# Altium schematic sheet Sensors.SchDoc
size 209 x 297 mm; Author: ALTIUM GOSTBOM2.0 KEV; SheetNumber: 3; SheetTotal: 3
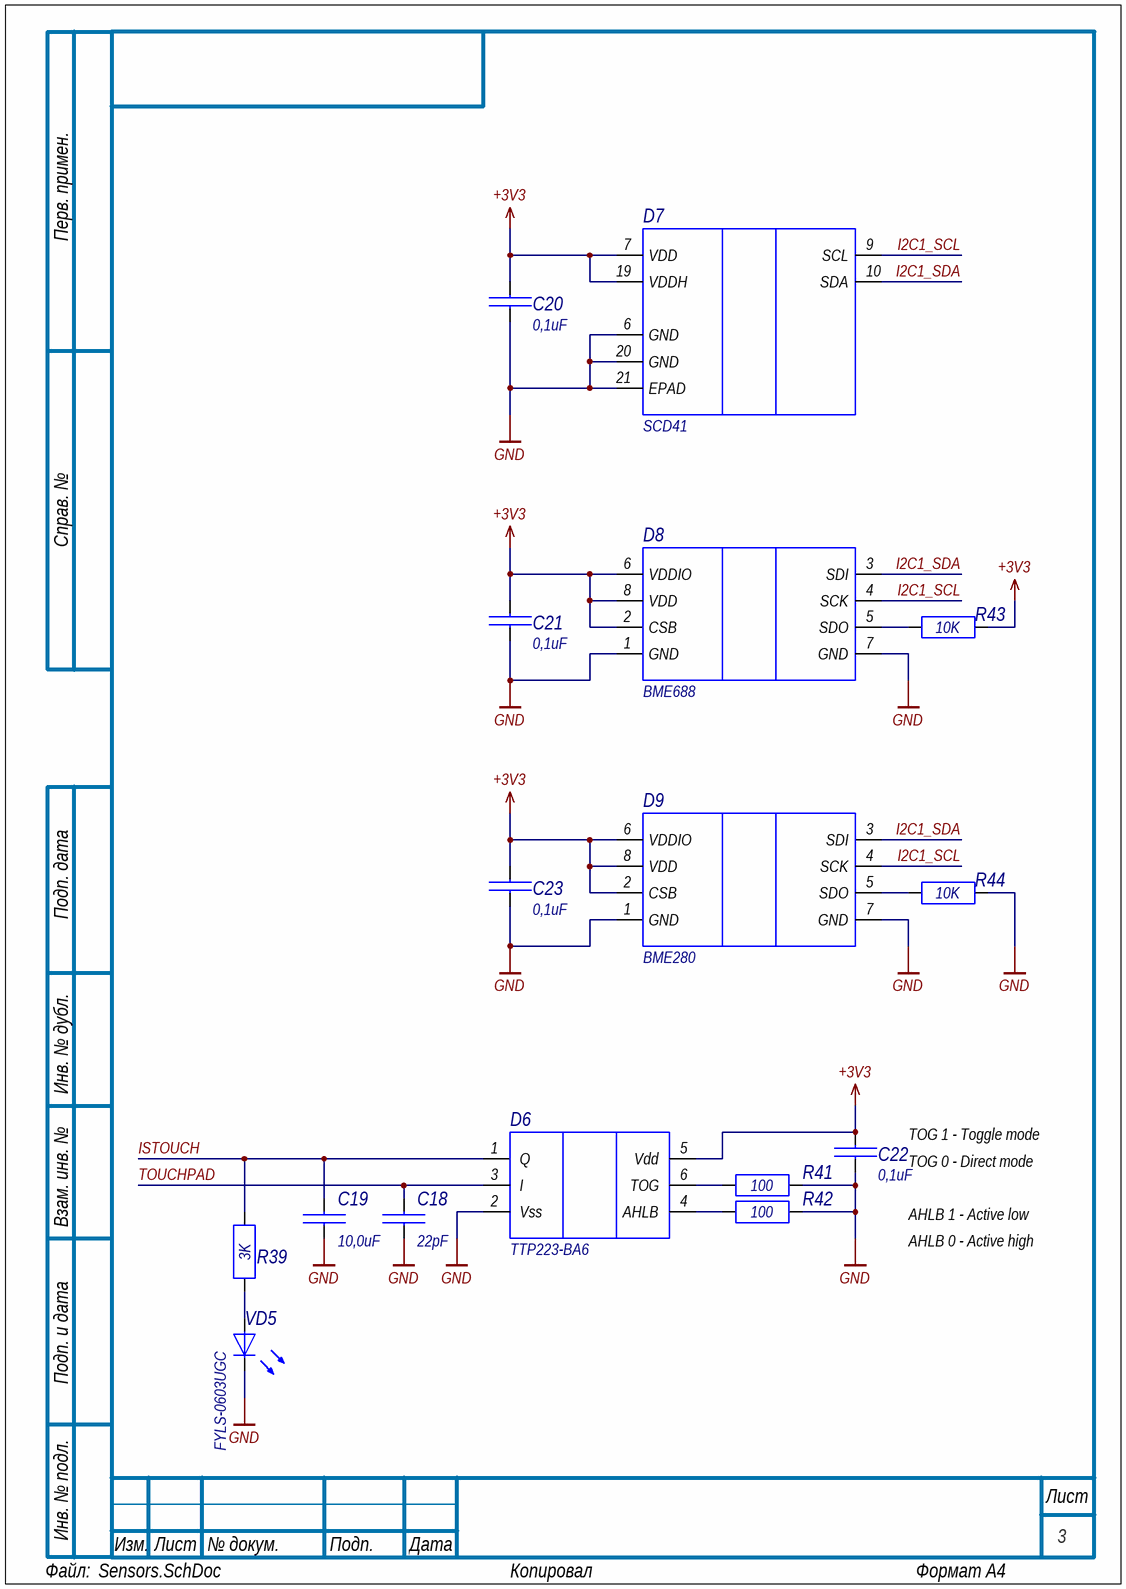
[diagram p0: Sensors.SchDoc]

## Parts
C18  value 22pF  [CAP_0603]  (hidden comment: CAPACITOR)
C19  value 10,0uF  [CAP_0603]  (hidden comment: CAPACITOR)
C20  value 0,1uF  [CAP_0603]  (hidden comment: CAPACITOR)
C21  value 0,1uF  [CAP_0603]  (hidden comment: CAPACITOR)
C22  value 0,1uF  [CAP_0603]  (hidden comment: CAPACITOR)
C23  value 0,1uF  [CAP_0603]  (hidden comment: CAPACITOR)
D6  TTP223-BA6  [SOT-23-6L_1]
D7  SCD41  [SCD41]
D8  value BME688  [BME688]  (hidden comment: BME_SENSOR)
D9  value BME280  [BME280]  (hidden comment: BME_SENSOR)
R39  value 3K  [RES_0603]  (hidden comment: RESISTOR)
R41  value 100  [RES_0603]  (hidden comment: RESISTOR)
R42  value 100  [RES_0603]  (hidden comment: RESISTOR)
R43  value 10K  [RES_0603]  (hidden comment: RESISTOR)
R44  value 10K  [RES_0603]  (hidden comment: RESISTOR)
VD5  value FYLS-0603UGC  [LED_0603_G]  (hidden comment: LED)

## Nets
+3V3: C20.1 C21.1 C22.1 C23.1 D6.5(Vdd) D7.7(VDD) D7.19(VDDH) D8.2(CSB) D8.6(VDDIO) D8.8(VDD) D9.2(CSB) D9.6(VDDIO) D9.8(VDD) R43.2
GND: C18.1 C19.2 C20.2 C21.2 C22.2 C23.2 D6.2(Vss) D7.6(GND) D7.20(GND) D7.21(EPAD) D8.1(GND) D8.7(GND) D9.1(GND) D9.7(GND) R41.2 R42.2 R44.2 VD5.K
I2C1_SCL: D7.9(SCL) D8.4(SCK) D9.4(SCK)
I2C1_SDA: D7.10(SDA) D8.3(SDI) D9.3(SDI)
ISTOUCH: C19.1 D6.1(Q) R39.2
TOUCHPAD: C18.2 D6.3(I)
NetD6_4: D6.4(AHLB) R42.1
NetD6_6: D6.6(TOG) R41.1
NetD8_5: D8.5(SDO) R43.1
NetD9_5: D9.5(SDO) R44.1
NetR39_1: R39.1 VD5.A

## Notes on the sheet
- (near C22) TOG 1 - Toggle mode
- (near C22) TOG 0 - Direct mode
- AHLB 1 - Active low
- AHLB 0 - Active high
- Перв. примен.
- Справ. №
- Подп. дата
- Инв. № дубл.
- Взам. инв. №
- Подп. и дата
- Инв. № подл.
- Изм.
- Лист
- № докум.
- Подп.
- Дата
- Файл:
- Копировал
- Формат А4

## Library data of the parts
C18 = CAP_CER_0603_220_50_5_C0G: Ceramic Capacitor SMD_0603 C0G; Manufacturer: Yageo; Manufacturer Part Number: CC0603JRNPO9BN220; Voltage: 50V; Tolerance: 5%; Part Number: CAP_CER_0603_220_50_5_C0G; Part Type: 0603; Size: 0603; Dielectric: C0G
C19 = CAP_CER_0603_106_25_10_X5R: Ceramic Capacitor SMD_0603 X5R; Manufacturer: Yageo; Manufacturer Part Number: CC0603KRX5R8BB106; Voltage: 25V; Tolerance: 10%; Replace: GRM188R61E106KA73D; Part Number: CAP_CER_0603_106_25_10_X5R; Part Type: 0603; Size: 0603; Dielectric: X5R
C20-C23 = CAP_CER_0603_104_25_10_X7R: Ceramic Capacitor SMD_0603 X7R; Manufacturer: Yageo; Manufacturer Part Number: CC0603KRX7R8BB104; Voltage: 25V; Tolerance: 10%; Part Number: CAP_CER_0603_104_25_10_X7R; Part Type: 0603; Size: 0603; Dielectric: X7R
D6 = TTP223-BA6: A touch pad detector; Manufacturer: Tontek; Value: TTP223-BA6; Part Number: TTP223-BA6; Part Type: LOGIC; Size: SOT-23-6L_1; Manufacturer Part Number: TTP223-BA6
D7 = SCD41: Replace: The SCD4x is SensirionвЂ™s next generation miniature CO2 / sensor; Value: SCD41; Part Number: SCD41; Part Type: LOGIC; Size: SCD41; Manufacturer: SCD41; Manufacturer Part Number: SCD41
D8 = BME688: Part Number: BME688; Part Type: LOGIC; Size: SMD-8P; Manufacturer: BME688; Manufacturer Part Number: BME688
D9 = BME280: Part Number: BME280; Part Type: LOGIC; Size: LGA-8(2.5x2.5); Manufacturer: BME280; Manufacturer Part Number: BME280
R39 = RES_SMD_0603_3K_5%: Resistor fixed SMD_0603 5%; Manufacturer: Yageo; Manufacturer Part Number: RC0603JR-073KL; Power: 100mW; Part Number: RES_SMD_0603_3K_5%; Part Type: 0603; Tolerance: 5%; Size: 0603
R41 R42 = RES_SMD_0603_100R_5%: Resistor fixed SMD_0603 5%; Manufacturer: Yageo; Manufacturer Part Number: RC0603JR-07100RL; Power: 100mW; Part Number: RES_SMD_0603_100R_5%; Part Type: 0603; Tolerance: 5%; Size: 0603
R43 R44 = RES_SMD_0603_10K_5%: Resistor fixed SMD_0603 5%; Manufacturer: Yageo; Manufacturer Part Number: RC0603JR-0710KL; Power: 100mW; Part Number: RES_SMD_0603_10K_5%; Part Type: 0603; Tolerance: 5%; Size: 0603
VD5 = FYLS-0603UGC: SMD 0603 LED Green; Manufacturer: Foryard; Replace: BL-HGE36G-AV-TR8; Part Number: FYLS-0603UGC; Part Type: LED; Size: 0603; Manufacturer Part Number: FYLS-0603UGC